# EAGLE design siren_cutdown (EAGLE 6.0)
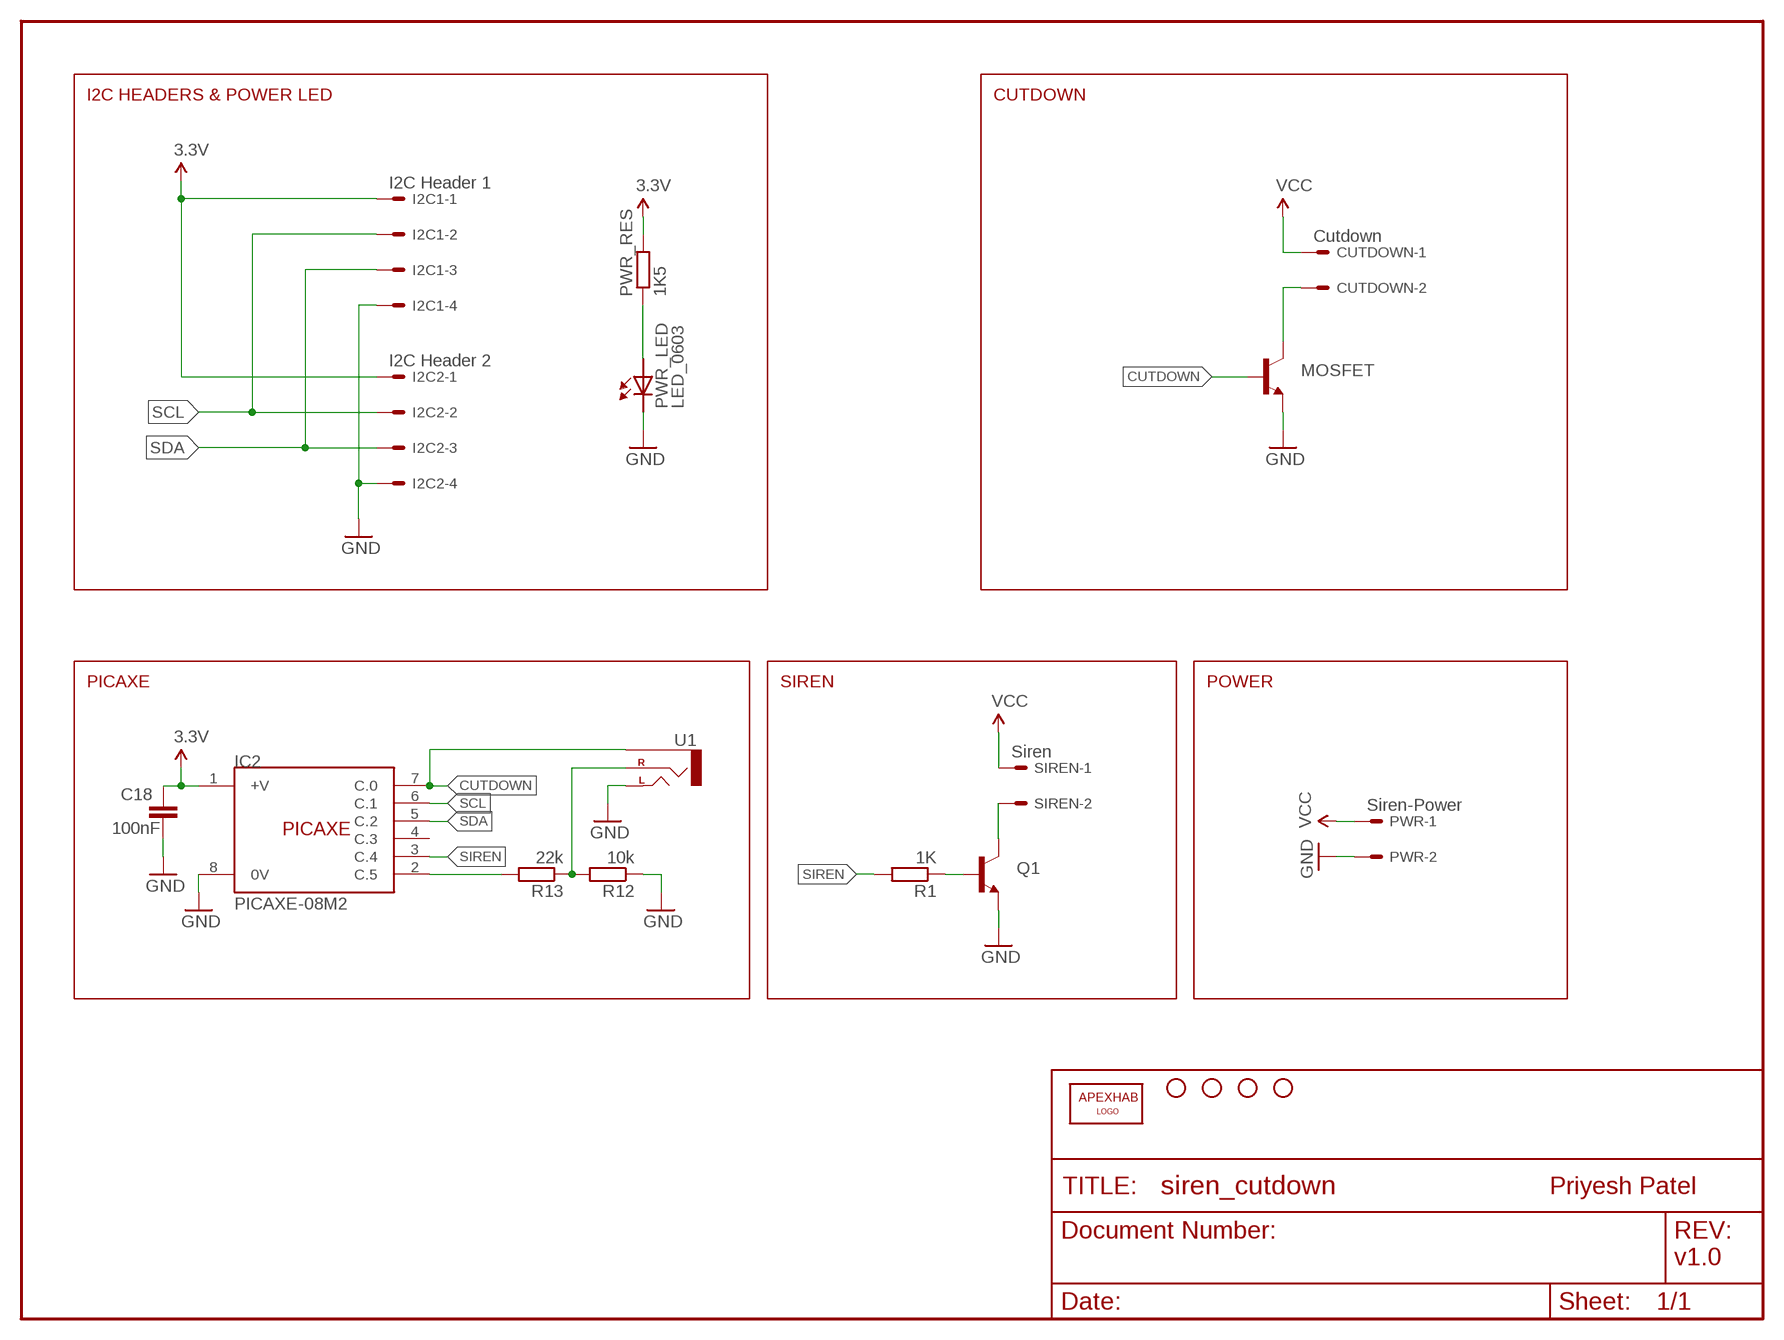
[diagram p0: schematic, sheet 1]

## Parts
C18  100nF  C-EUC0805  [C0805]
CUTDOWN  Cutdown  22-27-2021-02  [6410-02]
I2C1  I2C Header 1  22-27-2041-04  [6410-04]
I2C2  I2C Header 2  22-27-2041-04  [6410-04]
IC2  PICAXE-08M2  [SOIC8]
JP1  APEXHAB-LOGO_APEXHAB-SMALL  [APEXHAB-LOGO-SMALL]
JP2  STAND-OFF  [STAND-OFF]
JP3  STAND-OFF  [STAND-OFF]
JP4  STAND-OFF  [STAND-OFF]
JP5  STAND-OFF  [STAND-OFF]
MOSFET  TRANSISTOR_NPNSOT23  [SOT23]
PWR  Siren-Power  22-27-2021-02  [6410-02]
PWR_LED  LED_0603  [CHIPLED_0603]
PWR_RES  1K5  R-EU_R0805  [R0805]
Q1  TRANSISTOR_NPN"  [SOT223]
R1  1K  R-EU_R0805  [R0805]
R12  10k  R-EU_R0805  [R0805]
R13  22k  R-EU_R0805  [R0805]
SIREN  Siren  22-27-2021-02  [6410-02]
U1  AUDIO-JACKPTH  [AUDIO-JACK]

## Nets
3.3V: C18.1 I2C1.1 I2C2.1 IC2.1(+V) PWR_RES.2
CUTDOWN: IC2.7(C.0) MOSFET.1(B) U1.SLEEVE
GND: C18.2 I2C1.4 I2C2.4 IC2.8(0V) MOSFET.2(E) PWR.2 PWR_LED.C Q1.3(E) R12.1 U1.TIP(LEFT)
N$1: Q1.1(B) R1.1
N$2: Q1.2(C) SIREN.2
N$4: CUTDOWN.2 MOSFET.3(C)
N$17: IC2.2(C.5) R13.2
N$20: R12.2 R13.1 U1.RING(RIGHT)
N$21: PWR_LED.A PWR_RES.1
SCL: I2C1.2 I2C2.2 IC2.6(C.1)
SDA: I2C1.3 I2C2.3 IC2.5(C.2)
SIREN: IC2.3(C.4) R1.2
VCC: CUTDOWN.1 PWR.1 SIREN.1
Unconnected: IC2.4(C.3)

## Notes on the sheet
- I2C HEADERS & POWER LED | CUTDOWN
- PICAXE | SIREN | POWER
- Priyesh Patel
- v1.0

## Library data of the parts
C18 = rcl:C-EU: CAPACITOR, European symbol
CUTDOWN PWR SIREN = apex:22-?-02: CONNECTOR wire to board 2.54 mm (.1 inch) pitch header; OC_FARNELL: unknown; OC_NEWARK: unknown
I2C1 I2C2 = apex:22-?-04: CONNECTOR wire to board 2.54 mm (.1 inch) pitch header; OC_FARNELL: unknown; OC_NEWARK: unknown
IC2 = apex:PICAXE-08M2
JP1 = apex:APEXHAB-LOGO: ApexHAB PCB Logo This is the standard ApexHAB PCB logo.
JP2-JP5 = apex:STAND-OFF: Stand Off This is the mechanical footprint for a #4 phillips button head screw. Use the keepout ring to avoid running the screw head into surrounding components. SKU : PRT-00447
MOSFET Q1 = SparkFun:TRANSISTOR_NPN: Transistor NPN BJT configuration in SOT23 package. MMBT2222 is the common NPN we use. Double check BCE configuration again layout.
PWR_LED = apex:LED: SMD LED
PWR_RES R1 R12 R13 = rcl:R-EU_: RESISTOR, European symbol
U1 = SparkFun:AUDIO-JACK: 3.5mm Audio Jack Simple 3.5mm common PCB mount audio jack. SKU: PRT-08032

## Board
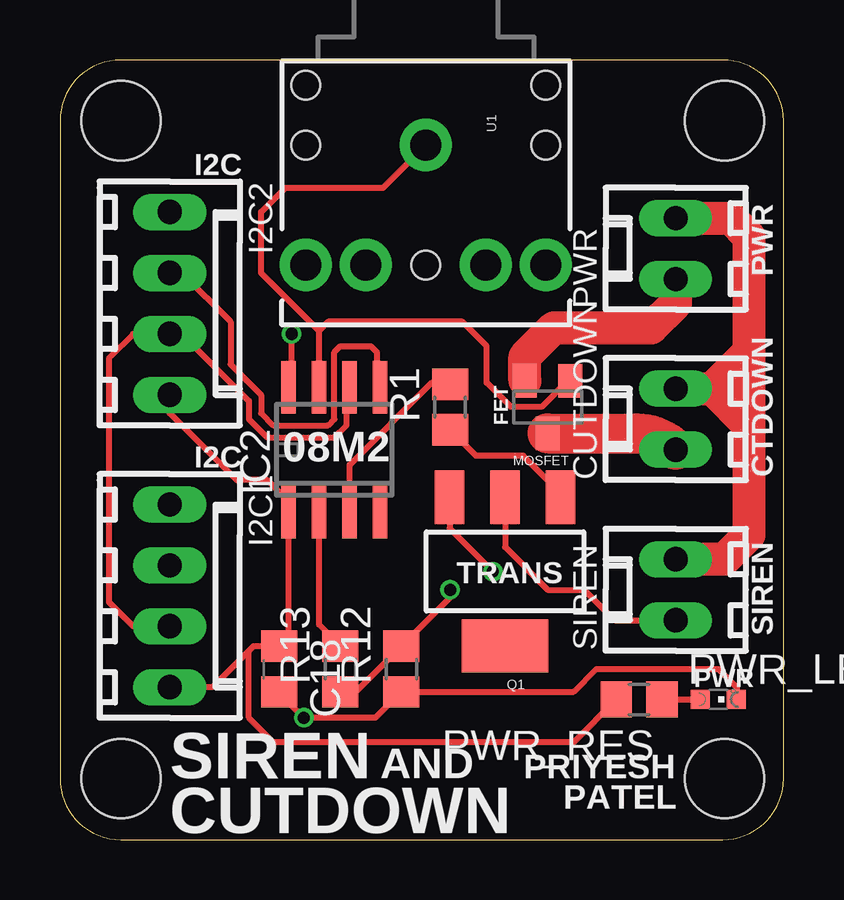
[diagram p1: board, top side]
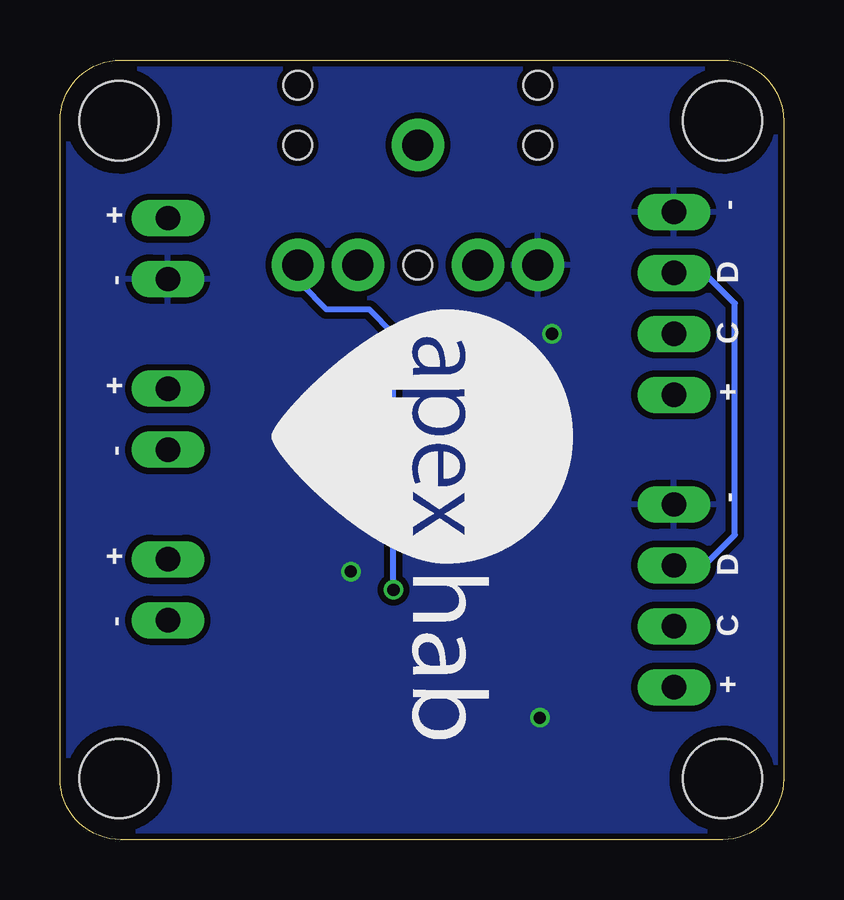
[diagram p2: board, bottom side, seen from below]

Size 30.15 x 32.5 mm. Coordinates in mm from the lower left corner, seen from the top.
Outline: 0,29.96 0,2.54 arc90 2.54,0 27.61,0 arc90 30.15,2.54 30.15,29.96 arc90 27.61,32.5 2.54,32.5 arc90 0,29.96
Copper layers (1*16): Top 0.035mm / dielectric 1.5mm / Bottom 0.035mm
Design rules: minimum track width 6mil, minimum drill 12mil, track to track 6mil, track to pad 6mil, pad to pad 6mil, via to via 6mil, smd to smd 0mil, copper to edge 10mil, drill to drill 10mil, minimum pad ring 10mil, minimum via ring 6mil, stop-mask expansion 2mil, vias tented up to drill 100mil, thermal gap 10mil

### Footprints (pad centres in the part's own frame; a part is rotated, then mirrored left to right if it is on the bottom)
C0805 = smd 1.3 x 1.5: 1 -0.95,0; 2 0.95,0
6410-02 = drill 1.016 long: 1 1.27,0; 2 -1.27,0
6410-04 = drill 1.016 long: 1 3.81,0; 2 1.27,0; 3 -1.27,0; 4 -3.81,0
SOIC8 = smd 0.6 x 2.2: 1 -1.905,-2.6; 2 -0.635,-2.6; 3 0.635,-2.6; 4 1.905,-2.6; 5 1.905,2.6; 6 0.635,2.6; 7 -0.635,2.6; 8 -1.905,2.6
STAND-OFF = hole 3.302: 0,0
SOT23 = smd 1 x 1.4: 1 -0.95,-1.1; 2 0.95,-1.1; 3 0,1.1
CHIPLED_0603 = smd 0.8 x 0.8: A 0,-0.75; C 0,0.75
R0805 = smd 1.3 x 1.5: 1 -0.95,0; 2 0.95,0
SOT223 = smd 1.219 x 2.235: 1 -2.311,-3.099; 2 0,-3.099; 3 2.311,-3.099 | smd 3.6 x 2.2: 4 0,3.099
AUDIO-JACK = drill 1.3 pad 2.184: RING 5,5; RSH 5,2.5; SLEEVE 0,0; TIP 5,-5; TSH 5,-2.5 | hole 1.2: 0,5; -2.5,5; -2.5,-5; 0,-5; 5,0

### Placement (x,y rotation side)
C18  9.14,7.11 270 top
CUTDOWN  25.65,17.53 90 top
I2C1  4.57,10.16 270 top
I2C2  4.57,22.35 270 top
IC2  11.43,16.26 0 top
JP1  21.34,22.1 270 bottom
JP2  2.54,29.97 0 top
JP3  27.69,29.97 0 top
JP4  2.54,2.54 0 top
JP5  27.69,2.54 0 top
MOSFET  20.32,18.03 180 top
PWR  25.65,24.64 90 top
PWR_LED  27.43,5.84 270 top
PWR_RES  24.13,5.84 180 top
Q1  18.54,11.18 180 top
R1  16.26,18.03 90 top
R12  14.22,7.11 90 top
R13  11.68,7.11 90 top
SIREN  25.65,10.41 90 top
U1  15.24,28.96 270 top

### Tracks (layer width: path | path; a pad name or v marks a point on that pad's centre or on a via)
3.3V
  Top 0.254: 7.87,7.87 8.06,8.06 C18.1 9.53,8.44 IC2.1 9.53,14.1 8.64,14.99 7.37,14.99 4.57,17.78 I2C2.1 | 7.87,7.87 6.35,6.35 I2C1.1 | PWR_RES.2 21.4,4.06 8.89,4.06 7.87,5.08 7.87,7.87
CUTDOWN
  Top 0.254: IC2.7 10.79,21.21 | 10.79,21.21 8.38,23.62 8.38,26.16 9.4,27.18 13.46,27.18 U1.SLEEVE | 10.79,21.21 11.18,21.59 16.76,21.59 17.78,20.57 17.78,19.05 18.8,18.03 20.07,18.03 21.17,19.13 MOSFET.1
GND  (via drill 0.51)
  Top 0.254: IC2.8 9.65,18.98 v9.65,21.08 | C18.2 9.14,6.1 v10.16,5.08 13.14,5.08 R12.1 21.4,6.16 22.35,7.11 27.43,7.11 28.19,6.35 28.19,5.85 PWR_LED.C | Q1.3 16.23,12.98 v18.03,11.18
  Top 1.372: MOSFET.2 19.37,20.13 20.57,21.34 24.64,21.34 25.65,22.35 PWR.2
  pour Bottom (isolate 0.254): 0,0 0,32.51 30.23,32.51 30.23,0
N$1
  Top 0.254: Q1.1 20.85,14.45 19.3,16 17.34,16 R1.1
N$2
  Top 0.254: Q1.2 18.54,12.19 20.32,10.41 21.84,10.41 23.11,9.14 SIREN.2
N$4
  Top 1.676: MOSFET.3 24.02,16.93 arc-45 CUTDOWN.2
N$17
  Top 0.254: R13.2 10.79,8.95 IC2.2
N$20  (via drill 0.51)
  Top 0.254: R13.1 12.32,6.16 R12.2 16.26,10.09 v16.26,10.41
  Bottom 0.254: v16.26,10.41 16.26,21.08 17.27,22.1 19.05,22.1 20.07,23.11 20.07,23.78 U1.RING
N$21
  Top 0.254: PWR_RES.1 PWR_LED.A
SCL
  Top 0.254: I2C1.2 3.05,8.89 2.03,9.91 2.03,20.07 3.05,21.08 I2C2.2 5.08,21.08 7.87,18.29 7.87,17.53 8.64,16.76 11.43,16.76 11.94,17.27 11.94,18.73 IC2.6
SDA
  Top 0.254: I2C2.3 5.08,23.62 7.11,21.59 7.11,19.81 8.38,18.54 8.38,17.78 8.89,17.27 11.18,17.27 11.43,17.53 11.43,20.32 11.68,20.57 12.95,20.57 13.21,20.32 13.21,18.98 IC2.5
  Bottom 0.254: I2C1.3 3.3,11.43 2.03,12.7 2.03,22.35 3.3,23.62 I2C2.3
SIREN
  Top 0.254: IC2.3 12.06,15.62 15.49,19.05 16.19,19.05 R1.2
VCC
  Top 1.372: PWR.1 27.94,25.91 28.7,25.15 28.7,20.32 | 28.7,20.32 28.7,18.29 | 28.7,18.29 28.7,17.27 | 28.7,17.27 28.7,12.7 27.69,11.68 SIREN.1 | CUTDOWN.1 27.18,18.8 | 27.18,18.8 28.19,18.8 28.7,18.29 | 27.18,18.8 28.7,20.32 | 27.18,18.8 28.7,17.27

### Text on the board
tPlace: I2C | PWR | FET | 08M2 | I2C | CTDOWN | TRANS | SIREN | PWR | SIREN | AND | PRIYESH | PATEL | CUTDOWN
bPlace: - | + | D | - | C | + | + | - | - | D | + | C | - | +